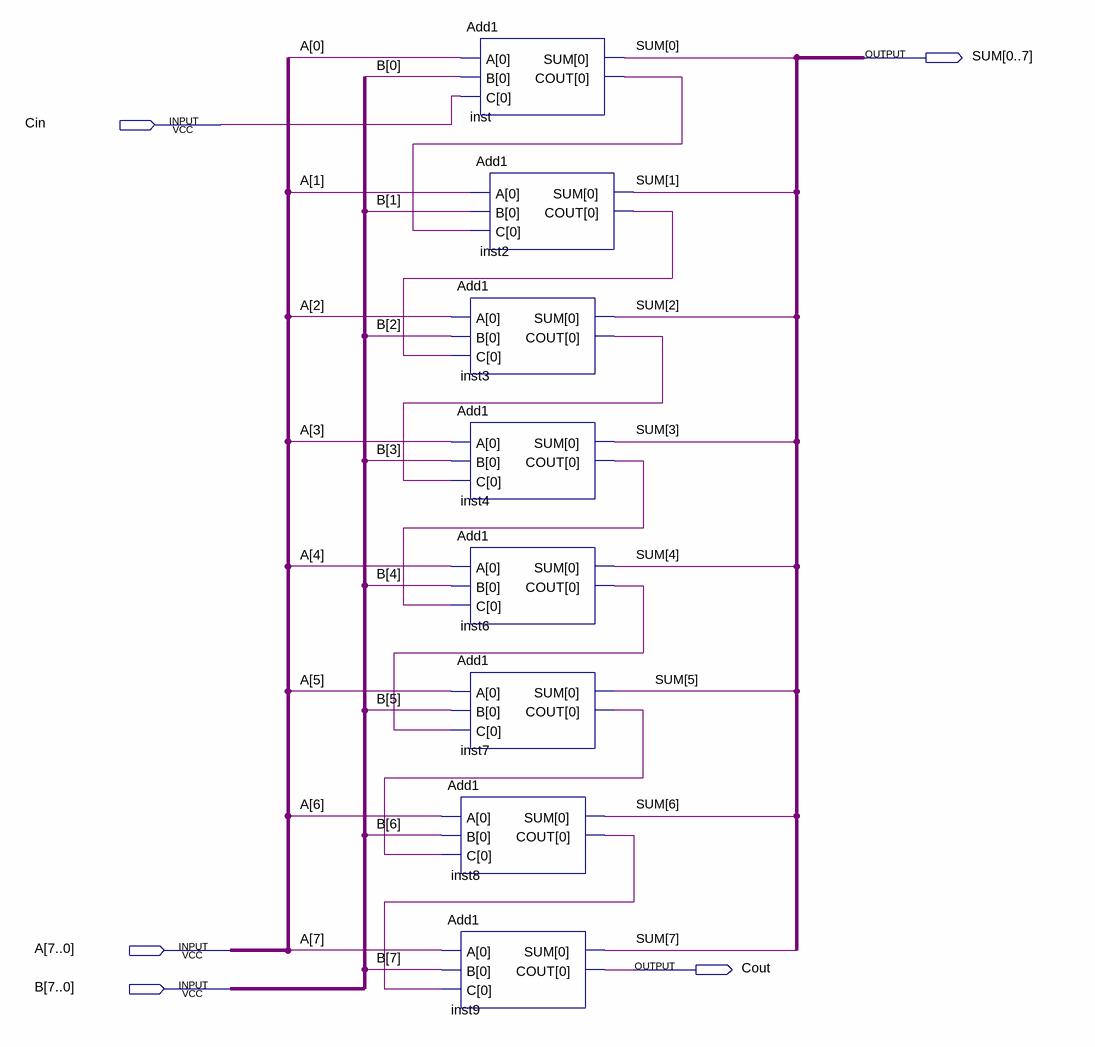
[diagram p0: schematic sheet]
// Quartus schematic Add8.bdf as structural Verilog: 8 symbols, 5 pins
module Add8 (
  input  Cin,
  input  [7:0] A,
  input  [7:0] B,
  output [0:7] SUM,
  output Cout
);

  wire inst2_cout, inst3_cout, inst4_cout, inst6_cout, inst7_cout, inst8_cout, inst_cout;

  Add1 inst (.A(A[0]), .B(B[0]), .C(Cin), .SUM(SUM[0]), .COUT(inst_cout));
  Add1 inst2 (.A(A[1]), .B(B[1]), .C(inst_cout), .SUM(SUM[1]), .COUT(inst2_cout));
  Add1 inst3 (.A(A[2]), .B(B[2]), .C(inst2_cout), .SUM(SUM[2]), .COUT(inst3_cout));
  Add1 inst4 (.A(A[3]), .B(B[3]), .C(inst3_cout), .SUM(SUM[3]), .COUT(inst4_cout));
  Add1 inst6 (.A(A[4]), .B(B[4]), .C(inst4_cout), .SUM(SUM[4]), .COUT(inst6_cout));
  Add1 inst7 (.A(A[5]), .B(B[5]), .C(inst6_cout), .SUM(SUM[5]), .COUT(inst7_cout));
  Add1 inst8 (.A(A[6]), .B(B[6]), .C(inst7_cout), .SUM(SUM[6]), .COUT(inst8_cout));
  Add1 inst9 (.A(A[7]), .B(B[7]), .C(inst8_cout), .SUM(SUM[7]), .COUT(Cout));
endmodule
